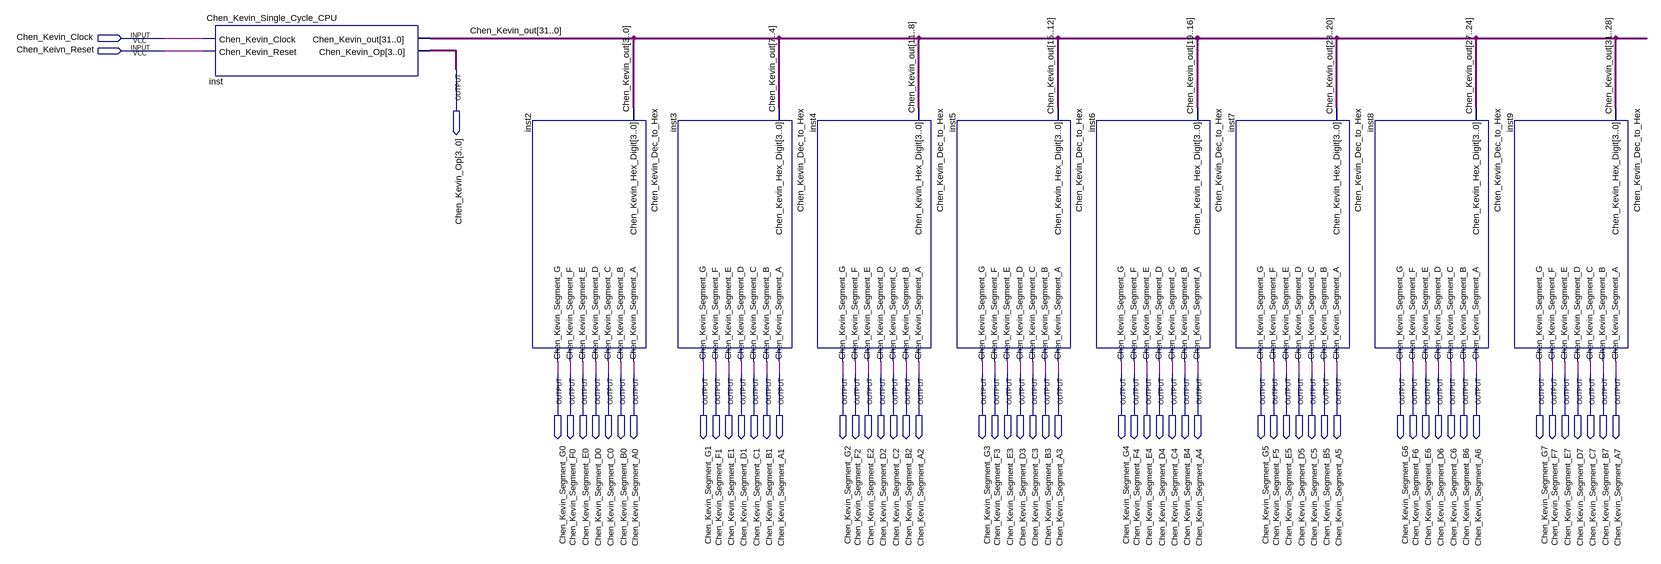
[diagram p0: schematic sheet]
// Quartus schematic Chen_Kevin_Single_Cycle_CPU_Board.bdf as structural Verilog: 9 symbols, 59 pins
module Chen_Kevin_Single_Cycle_CPU_Board (
  input  Chen_Kevin_Clock,
  input  Chen_Keivn_Reset,
  output [3:0] Chen_Kevin_Op,
  output Chen_Kevin_Segment_G0,
  output Chen_Kevin_Segment_F0,
  output Chen_Kevin_Segment_E0,
  output Chen_Kevin_Segment_D0,
  output Chen_Kevin_Segment_C0,
  output Chen_Kevin_Segment_B0,
  output Chen_Kevin_Segment_A0,
  output Chen_Kevin_Segment_G1,
  output Chen_Kevin_Segment_F1,
  output Chen_Kevin_Segment_E1,
  output Chen_Kevin_Segment_D1,
  output Chen_Kevin_Segment_C1,
  output Chen_Kevin_Segment_B1,
  output Chen_Kevin_Segment_A1,
  output Chen_Kevin_Segment_G2,
  output Chen_Kevin_Segment_F2,
  output Chen_Kevin_Segment_E2,
  output Chen_Kevin_Segment_D2,
  output Chen_Kevin_Segment_C2,
  output Chen_Kevin_Segment_B2,
  output Chen_Kevin_Segment_A2,
  output Chen_Kevin_Segment_G3,
  output Chen_Kevin_Segment_F3,
  output Chen_Kevin_Segment_E3,
  output Chen_Kevin_Segment_D3,
  output Chen_Kevin_Segment_C3,
  output Chen_Kevin_Segment_B3,
  output Chen_Kevin_Segment_A3,
  output Chen_Kevin_Segment_G4,
  output Chen_Kevin_Segment_F4,
  output Chen_Kevin_Segment_E4,
  output Chen_Kevin_Segment_D4,
  output Chen_Kevin_Segment_C4,
  output Chen_Kevin_Segment_B4,
  output Chen_Kevin_Segment_A4,
  output Chen_Kevin_Segment_G5,
  output Chen_Kevin_Segment_F5,
  output Chen_Kevin_Segment_E5,
  output Chen_Kevin_Segment_D5,
  output Chen_Kevin_Segment_C5,
  output Chen_Kevin_Segment_B5,
  output Chen_Kevin_Segment_A5,
  output Chen_Kevin_Segment_G6,
  output Chen_Kevin_Segment_F6,
  output Chen_Kevin_Segment_E6,
  output Chen_Kevin_Segment_D6,
  output Chen_Kevin_Segment_C6,
  output Chen_Kevin_Segment_B6,
  output Chen_Kevin_Segment_A6,
  output Chen_Kevin_Segment_G7,
  output Chen_Kevin_Segment_F7,
  output Chen_Kevin_Segment_E7,
  output Chen_Kevin_Segment_D7,
  output Chen_Kevin_Segment_C7,
  output Chen_Kevin_Segment_B7,
  output Chen_Kevin_Segment_A7
);

  wire [31:0] Chen_Kevin_out;

  Chen_Kevin_Single_Cycle_CPU inst (
    .Chen_Kevin_Clock(Chen_Kevin_Clock), .Chen_Kevin_Reset(Chen_Keivn_Reset),
    .Chen_Kevin_out(Chen_Kevin_out), .Chen_Kevin_Op(Chen_Kevin_Op));
  Chen_Kevin_Dec_to_Hex inst2 (
    .Chen_Kevin_Hex_Digit(Chen_Kevin_out[3:0]), .Chen_Kevin_Segment_A(Chen_Kevin_Segment_A0),
    .Chen_Kevin_Segment_B(Chen_Kevin_Segment_B0), .Chen_Kevin_Segment_C(Chen_Kevin_Segment_C0),
    .Chen_Kevin_Segment_D(Chen_Kevin_Segment_D0), .Chen_Kevin_Segment_E(Chen_Kevin_Segment_E0),
    .Chen_Kevin_Segment_F(Chen_Kevin_Segment_F0), .Chen_Kevin_Segment_G(Chen_Kevin_Segment_G0));
  Chen_Kevin_Dec_to_Hex inst3 (
    .Chen_Kevin_Hex_Digit(Chen_Kevin_out[7:4]), .Chen_Kevin_Segment_A(Chen_Kevin_Segment_A1),
    .Chen_Kevin_Segment_B(Chen_Kevin_Segment_B1), .Chen_Kevin_Segment_C(Chen_Kevin_Segment_C1),
    .Chen_Kevin_Segment_D(Chen_Kevin_Segment_D1), .Chen_Kevin_Segment_E(Chen_Kevin_Segment_E1),
    .Chen_Kevin_Segment_F(Chen_Kevin_Segment_F1), .Chen_Kevin_Segment_G(Chen_Kevin_Segment_G1));
  Chen_Kevin_Dec_to_Hex inst4 (
    .Chen_Kevin_Hex_Digit(Chen_Kevin_out[11:8]), .Chen_Kevin_Segment_A(Chen_Kevin_Segment_A2),
    .Chen_Kevin_Segment_B(Chen_Kevin_Segment_B2), .Chen_Kevin_Segment_C(Chen_Kevin_Segment_C2),
    .Chen_Kevin_Segment_D(Chen_Kevin_Segment_D2), .Chen_Kevin_Segment_E(Chen_Kevin_Segment_E2),
    .Chen_Kevin_Segment_F(Chen_Kevin_Segment_F2), .Chen_Kevin_Segment_G(Chen_Kevin_Segment_G2));
  Chen_Kevin_Dec_to_Hex inst5 (
    .Chen_Kevin_Hex_Digit(Chen_Kevin_out[15:12]), .Chen_Kevin_Segment_A(Chen_Kevin_Segment_A3),
    .Chen_Kevin_Segment_B(Chen_Kevin_Segment_B3), .Chen_Kevin_Segment_C(Chen_Kevin_Segment_C3),
    .Chen_Kevin_Segment_D(Chen_Kevin_Segment_D3), .Chen_Kevin_Segment_E(Chen_Kevin_Segment_E3),
    .Chen_Kevin_Segment_F(Chen_Kevin_Segment_F3), .Chen_Kevin_Segment_G(Chen_Kevin_Segment_G3));
  Chen_Kevin_Dec_to_Hex inst6 (
    .Chen_Kevin_Hex_Digit(Chen_Kevin_out[19:16]), .Chen_Kevin_Segment_A(Chen_Kevin_Segment_A4),
    .Chen_Kevin_Segment_B(Chen_Kevin_Segment_B4), .Chen_Kevin_Segment_C(Chen_Kevin_Segment_C4),
    .Chen_Kevin_Segment_D(Chen_Kevin_Segment_D4), .Chen_Kevin_Segment_E(Chen_Kevin_Segment_E4),
    .Chen_Kevin_Segment_F(Chen_Kevin_Segment_F4), .Chen_Kevin_Segment_G(Chen_Kevin_Segment_G4));
  Chen_Kevin_Dec_to_Hex inst7 (
    .Chen_Kevin_Hex_Digit(Chen_Kevin_out[23:20]), .Chen_Kevin_Segment_A(Chen_Kevin_Segment_A5),
    .Chen_Kevin_Segment_B(Chen_Kevin_Segment_B5), .Chen_Kevin_Segment_C(Chen_Kevin_Segment_C5),
    .Chen_Kevin_Segment_D(Chen_Kevin_Segment_D5), .Chen_Kevin_Segment_E(Chen_Kevin_Segment_E5),
    .Chen_Kevin_Segment_F(Chen_Kevin_Segment_F5), .Chen_Kevin_Segment_G(Chen_Kevin_Segment_G5));
  Chen_Kevin_Dec_to_Hex inst8 (
    .Chen_Kevin_Hex_Digit(Chen_Kevin_out[27:24]), .Chen_Kevin_Segment_A(Chen_Kevin_Segment_A6),
    .Chen_Kevin_Segment_B(Chen_Kevin_Segment_B6), .Chen_Kevin_Segment_C(Chen_Kevin_Segment_C6),
    .Chen_Kevin_Segment_D(Chen_Kevin_Segment_D6), .Chen_Kevin_Segment_E(Chen_Kevin_Segment_E6),
    .Chen_Kevin_Segment_F(Chen_Kevin_Segment_F6), .Chen_Kevin_Segment_G(Chen_Kevin_Segment_G6));
  Chen_Kevin_Dec_to_Hex inst9 (
    .Chen_Kevin_Hex_Digit(Chen_Kevin_out[31:28]), .Chen_Kevin_Segment_A(Chen_Kevin_Segment_A7),
    .Chen_Kevin_Segment_B(Chen_Kevin_Segment_B7), .Chen_Kevin_Segment_C(Chen_Kevin_Segment_C7),
    .Chen_Kevin_Segment_D(Chen_Kevin_Segment_D7), .Chen_Kevin_Segment_E(Chen_Kevin_Segment_E7),
    .Chen_Kevin_Segment_F(Chen_Kevin_Segment_F7), .Chen_Kevin_Segment_G(Chen_Kevin_Segment_G7));
endmodule
